# Altium project Power_switch_NEOWELT.PrjPcb
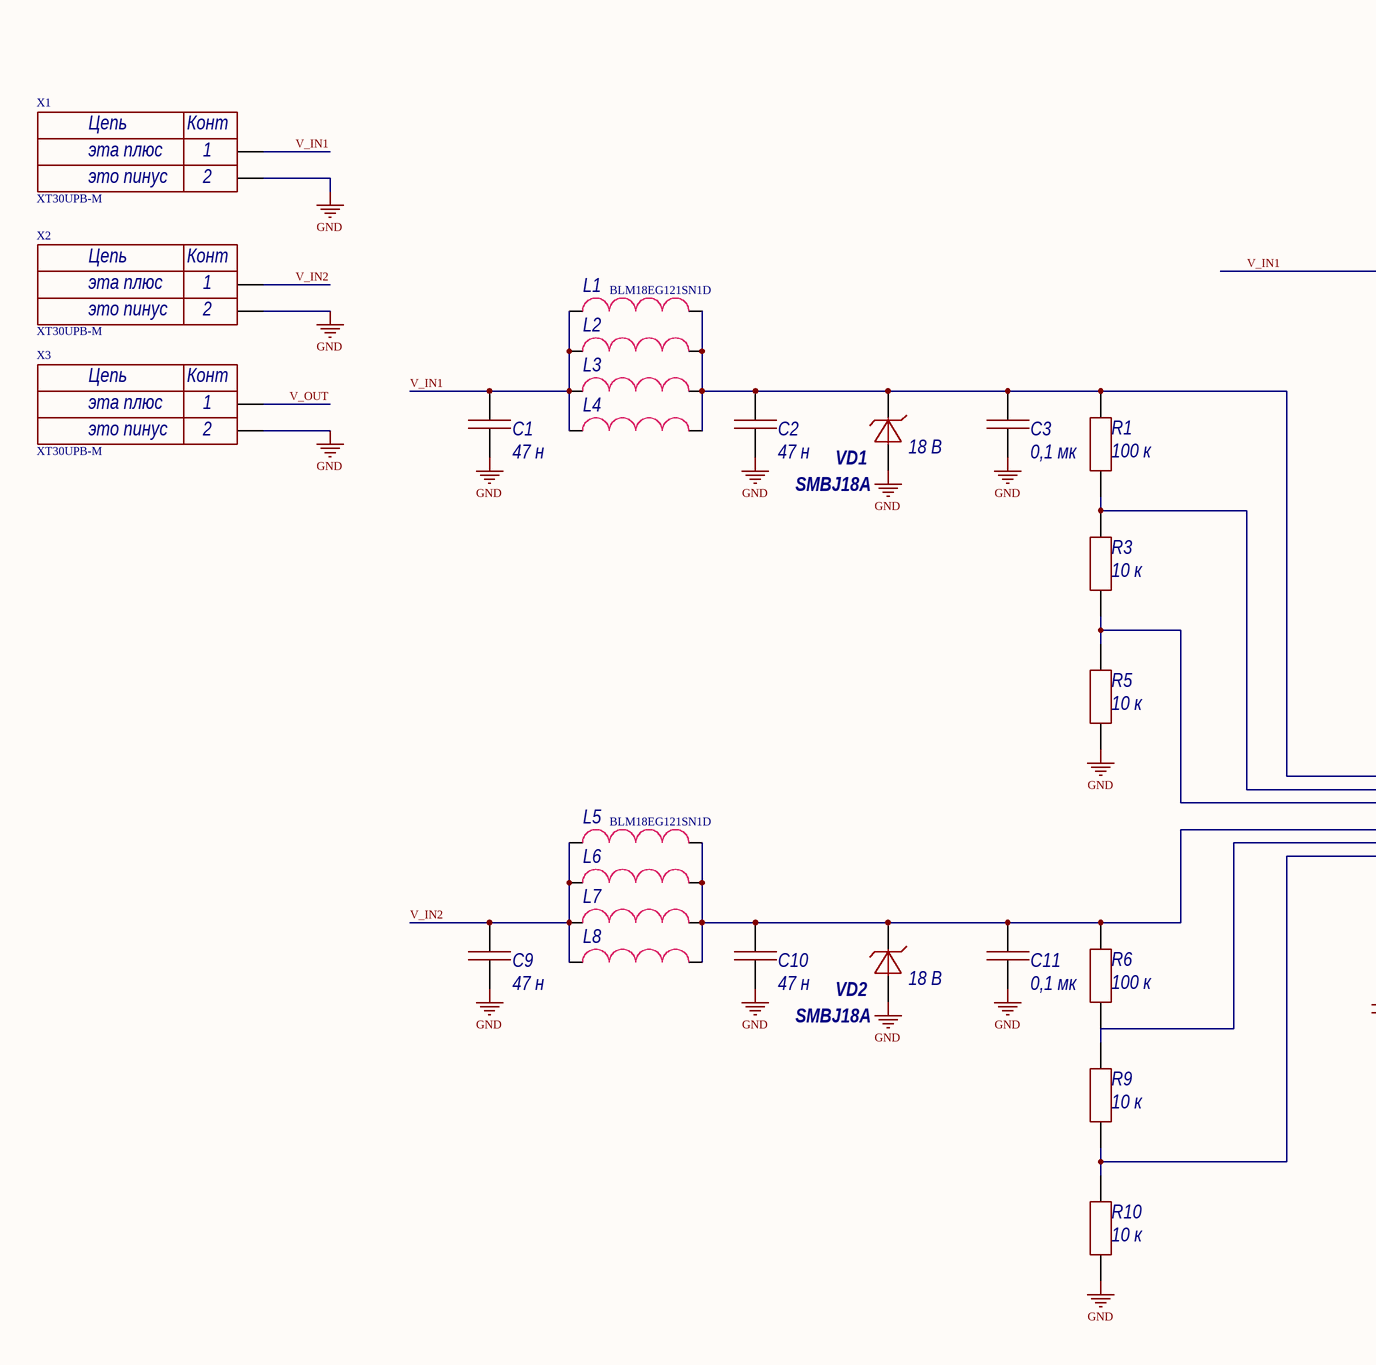
[diagram p0: Sheet1.SchDoc, left]
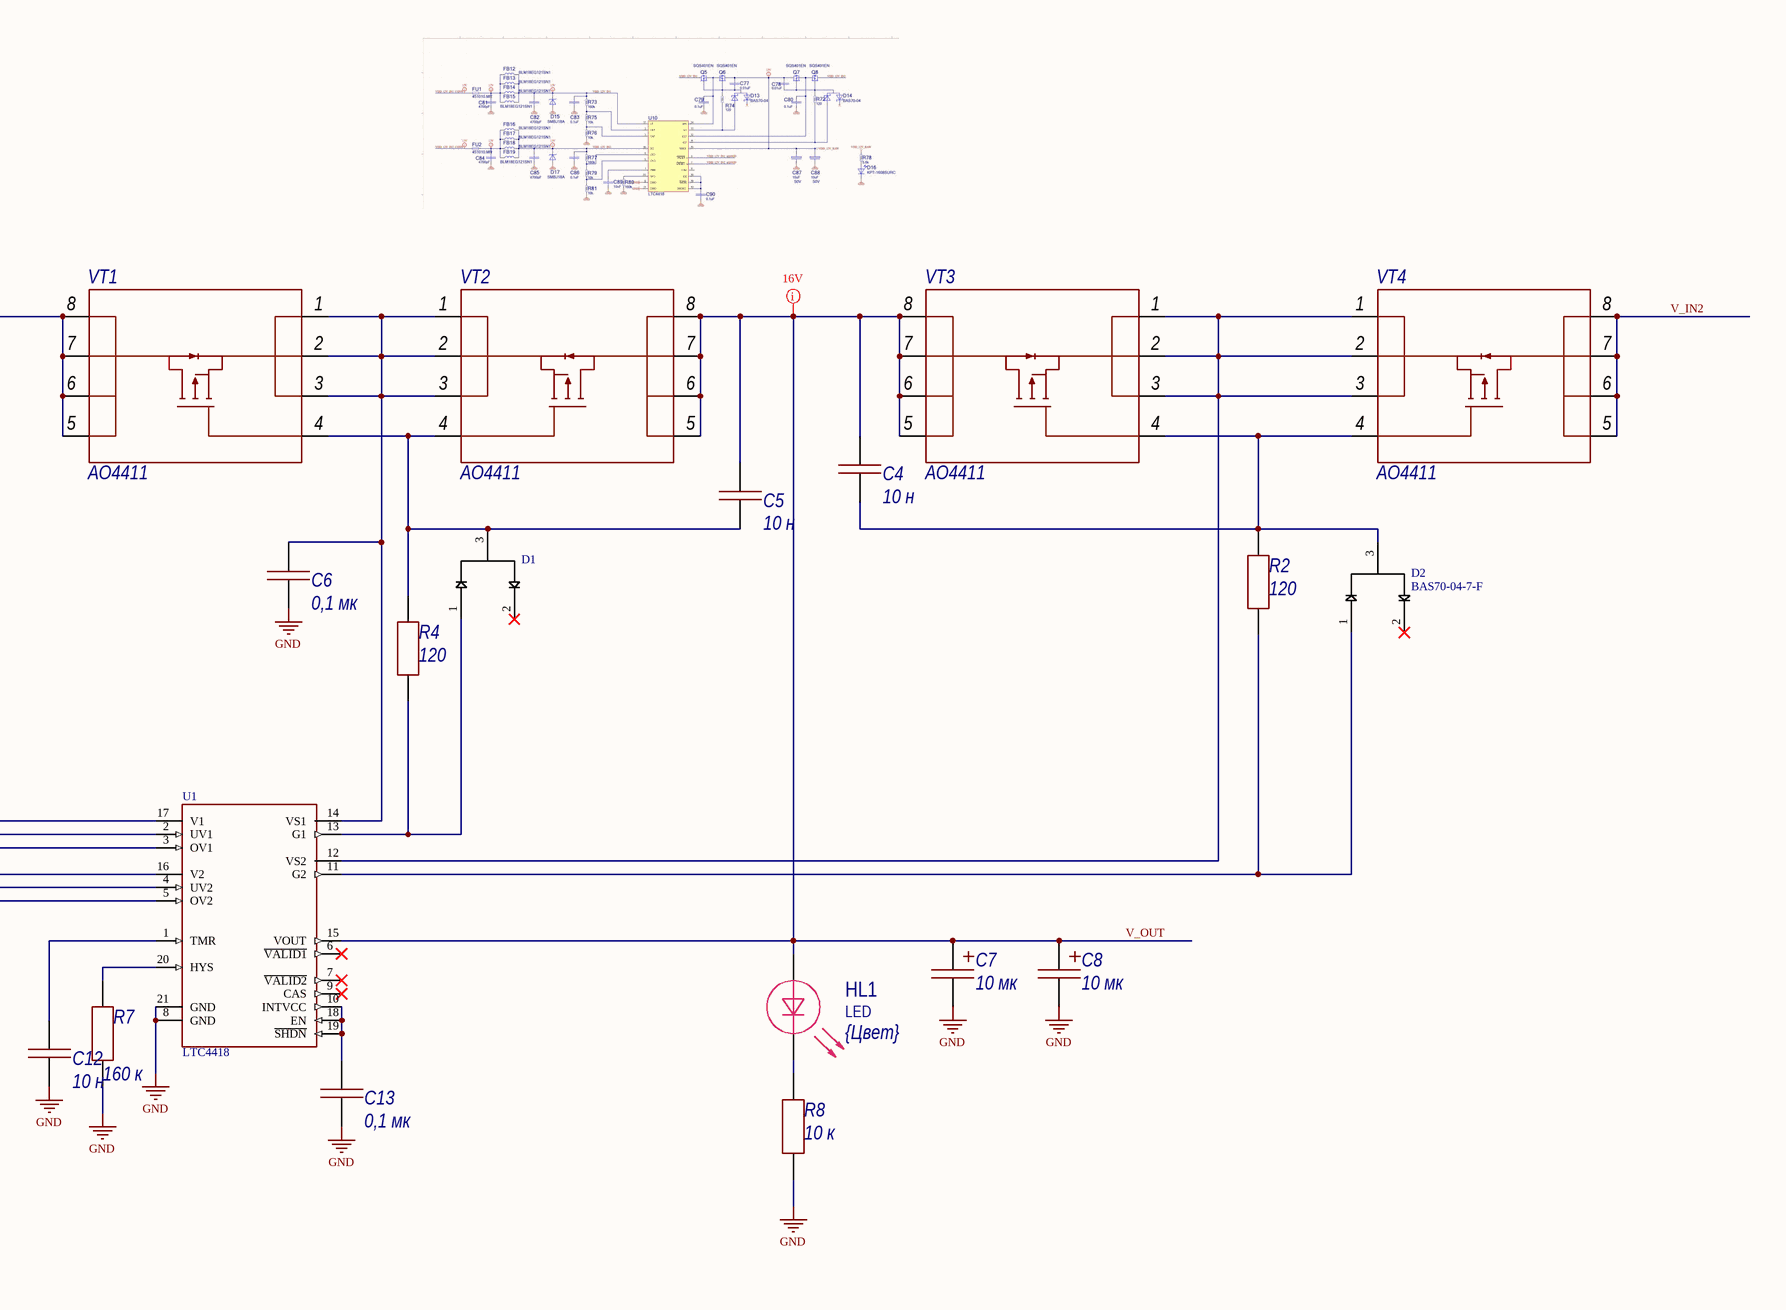
[diagram p1: Sheet1.SchDoc, right]
1 sheet, 44 parts. Net scope: global (net labels, ports and power ports of the same name join across sheets).
Board file: Power_switch_pcb.PcbDoc

## Sheet Sheet1.SchDoc
size A1; SheetNumber: 1; SheetTotal: 1

### Parts
C1  value 47 н  [0603C]  (hidden comment: Capacitor)
C2  value 47 н  [0603C]  (hidden comment: Capacitor)
C3  value 0,1 мк  [0603C]  (hidden comment: Capacitor)
C4  value 10 н  [0603C]  (hidden comment: Capacitor)
C5  value 10 н  [0603C]  (hidden comment: Capacitor)
C6  value 0,1 мк  [0603C]  (hidden comment: Capacitor)
C7  value 10 мк  [TC_A]  (hidden comment: Capacitor)
C8  value 10 мк  [TC_A]  (hidden comment: Capacitor)
C9  value 47 н  [0603C]  (hidden comment: Capacitor)
C10  value 47 н  [0603C]  (hidden comment: Capacitor)
C11  value 0,1 мк  [0603C]  (hidden comment: Capacitor)
C12  value 10 н  [0603C]  (hidden comment: Capacitor)
C13  value 0,1 мк  [0603C]  (hidden comment: Capacitor)
D1  (no value)  [SOT23]
D2  BAS70-04-7-F  [SOT23]
HL1  LED  Color: {Цвет}  [0805D]
L1  BLM18EG121SN1D  [0603L]
L2  Inductance  [0603L]  (value not drawn)
L3  Inductance  [0603L]  (value not drawn)
L4  Inductance  [0603L]  (value not drawn)
L5  BLM18EG121SN1D  [0603L]
L6  Inductance  [0603L]  (value not drawn)
L7  Inductance  [0603L]  (value not drawn)
L8  Inductance  [0603L]  (value not drawn)
R1  value 100 к  [0603R]  (hidden comment: Resistor)
R2  value 120  [0603R]  (hidden comment: Resistor)
R3  value 10 к  [0603R]  (hidden comment: Resistor)
R4  value 120  [0603R]  (hidden comment: Resistor)
R5  value 10 к  [0603R]  (hidden comment: Resistor)
R6  value 100 к  [0603R]  (hidden comment: Resistor)
R7  value 160 к  [0603R]  (hidden comment: Resistor)
R8  value 10 к  [0603R]  (hidden comment: Resistor)
R9  value 10 к  [0603R]  (hidden comment: Resistor)
R10  value 10 к  [0603R]  (hidden comment: Resistor)
U1  LTC4418  [QFN50]
VD1  SMBJ18A  value 18 В  [SMB]
VD2  SMBJ18A  value 18 В  [SMB]
VT1  AO4411  [SOIC-8]
VT2  AO4411  [SOIC-8]
VT3  AO4411  [SOIC-8]
VT4  AO4411  [SOIC-8]
X1  XT30UPB-M  Value2: это пинус  Value1: эта плюс  [XT30UPB-M]
X2  XT30UPB-M  Value2: это пинус  Value1: эта плюс  [XT30UPB-M]
X3  XT30UPB-M  Value2: это пинус  Value1: эта плюс  [XT30UPB-M]

### Nets
GND: C1.1 C2.1 C3.1 C6.1 C7.2 C8.2 C9.1 C10.1 C11.1 C12.1 C13.1 R5.1 R7.1 R8.1 R10.1 U1.8(GND) U1.21(GND) VD1.1 VD2.1 X1.N X2.N X3.N
V_IN1: C1.2 L1.1 L2.1 L3.1 L4.1 VT1.5 VT1.6 VT1.7 VT1.8 X1.P
V_IN2: C9.2 L5.1 L6.1 L7.1 L8.1 VT4.5 VT4.6 VT4.7 VT4.8 X2.P
V_OUT: C4.2 C5.2 C7.1 C8.1 HL1.1 U1.15(VOUT) VT2.5 VT2.6 VT2.7 VT2.8 VT3.5 VT3.6 VT3.7 VT3.8 X3.P
NetC2_2: C2.2 C3.2 L1.2 L2.2 L3.2 L4.2 R1.2 U1.17(V1) VD1.2
NetC4_1: C4.1 D2.3 R2.2 VT3.4 VT4.4
NetC5_1: C5.1 D1.3 R4.2 VT1.4 VT2.4
NetC6_2: C6.2 U1.14(VS1) VT1.1 VT1.2 VT1.3 VT2.1 VT2.2 VT2.3
NetC10_2: C10.2 C11.2 L5.2 L6.2 L7.2 L8.2 R6.2 U1.16(V2) VD2.2
NetC12_2: C12.2 U1.1(TMR)
NetC13_2: C13.2 U1.10(INTVCC) U1.18(EN) U1.19(~{SHDN})
NetD1_1: D1.1 R4.1 U1.13(G1)
NetD2_1: D2.1 R2.1 U1.11(G2)
NetHL1_2: HL1.2 R8.2
NetR1_1: R1.1 R3.2 U1.2(UV1)
NetR3_1: R3.1 R5.2 U1.3(OV1)
NetR6_1: R6.1 R9.2 U1.4(UV2)
NetR7_2: R7.2 U1.20(HYS)
NetR9_1: R9.1 R10.2 U1.5(OV2)
NetU1_12: U1.12(VS2) VT3.1 VT3.2 VT3.3 VT4.1 VT4.2 VT4.3

Not connected (* = marked no-connect by the designer): D1 2*; D2 2*; U1 6(~{VALID1})* 7(~{VALID2})* 9(CAS)*

### Layout directives
mark named 16V: V_OUT

### Notes on the sheet
- (in symbol XT30UPB-M) Цепь; Конт; 1; 2

### Library data of the parts
C1 C2 C9 C10 = Capacitor_47n_10_50V_X7R_0603C: Конденсатор; Tolerance: 0,1; Voltage (V): 50; Dielectric: X7R; Capacity (nF): 47; Part Number: Capacitor_47n_10_50V_X7R_0603C
C3 C6 C11 C13 = Capacitor_0,1u_10_50V_X7R_0603C: Конденсатор; Tolerance: 0,1; Voltage (V): 50; Dielectric: X7R; Capacity (nF): 100; Part Number: Capacitor_0,1u_10_50V_X7R_0603C
C4 C5 C12 = Capacitor_10n_10_50V_X7R_0603C: Конденсатор; Tolerance: 0,1; Voltage (V): 50; Dielectric: X7R; Capacity (nF): 10; Part Number: Capacitor_10n_10_50V_X7R_0603C
C7 C8 = Capacitor_10u_10_50V_TC_A: Танталовый конденсатор; Tolerance: 0,1; Voltage (V): 50; Type: Tantalum; Capacity (uF): 10; Part Number: Capacitor_10u_10_50V_TC_A
D1 D2 = BAS70-04-7-F: Diode Array 1 Pair Series Connection Schottky 70V 70mA (DC) Surface Mount TO-236-3, SC-59, SOT-23-3; MF: Diodes Inc.; Package: SOT-23 Diodes Inc.; Value: *; MP: BAS70-04-7-F; Mouser-Purchase-URL: https://snapeda.com/shop?store=Mouser&id=46815; SnapEDA_Link: https://www.snapeda.com/parts/BAS70-04-7-F/Diodes%20Inc./view-part/46815/?ref=snap; Availability: Good; Price: None; DigiKey-Purchase-URL: https://snapeda.com/shop?store=DigiKey&id=46815
HL1 = LED: Светодиод; Part Number: LED
L1-L8 = Inductance: Катушка индуктивности; Part Number: Inductance
R1 R6 = Resistor_100k_1_0603: Резистор номиналом 100 кОм и точностью 1%; Power: *; Part Number: Resistor_100k_1_0603; Tolerance: 1%
R2 R4 = Resistor_120_1_0603: Резистор номиналом 120 Ом и точностью 1%; Power: *; Part Number: Resistor_120_1_0603; Tolerance: 1%
R3 R5 R8-R10 = Resistor_10k_1_0603: Резистор номиналом 10 кОм и точностью 1%; Power: *; Part Number: Resistor_10k_1_0603; Tolerance: 1%
R7 = Resistor_160k_1_0603: Резистор номиналом 160 кОм и точностью 1%; Power: *; Part Number: Resistor_160k_1_0603; Tolerance: 1%
U1 = LTC4418: MF: Analog Devices; MP: LTC4418IUF#PBF; Package: QFN -20 Analog Devices; Price: None; Check_prices: https://www.snapeda.com/parts/LTC4418IUF%23PBF/Analog+Devices/view-part/?ref=eda; Value: *; SnapEDA_Link: https://www.snapeda.com/parts/LTC4418IUF%23PBF/Analog+Devices/view-part/?ref=snap; Availability: In Stock; Purchase-URL: https://pricing.snapeda.com/search?q=LTC4418IUF#PBF&ref=eda; Part Number: LTC4418
VD1 VD2 = SMBJ18A: Защитный диод на 18 В, рассеиваемая мощность 600 Вт; Part Number: SMBJ18A
VT1-VT4 = AO4411: P-канальный MOSFET; Part Number: AO4411
X1-X3 = XT30UPB-M: 2-пиновый разъем с ключом; Part Number: XT30UPB-M